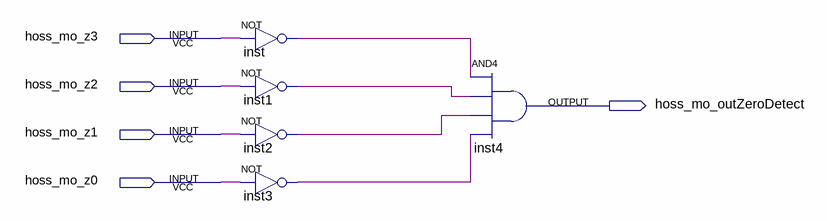
[diagram p0: schematic sheet]
// Quartus schematic zeroDetect.bdf as structural Verilog: 5 symbols, 5 pins
module zeroDetect (
  input  hoss_mo_z3,
  input  hoss_mo_z2,
  input  hoss_mo_z1,
  input  hoss_mo_z0,
  output hoss_mo_outZeroDetect
);

  wire inst1_out, inst2_out, inst3_out, inst_out;

  not inst (inst_out, hoss_mo_z3);
  not inst1 (inst1_out, hoss_mo_z2);
  not inst2 (inst2_out, hoss_mo_z1);
  not inst3 (inst3_out, hoss_mo_z0);
  and inst4 (hoss_mo_outZeroDetect, inst_out, inst1_out, inst2_out, inst3_out);
endmodule
